# EAGLE design 08A-005 (EAGLE 6.3)
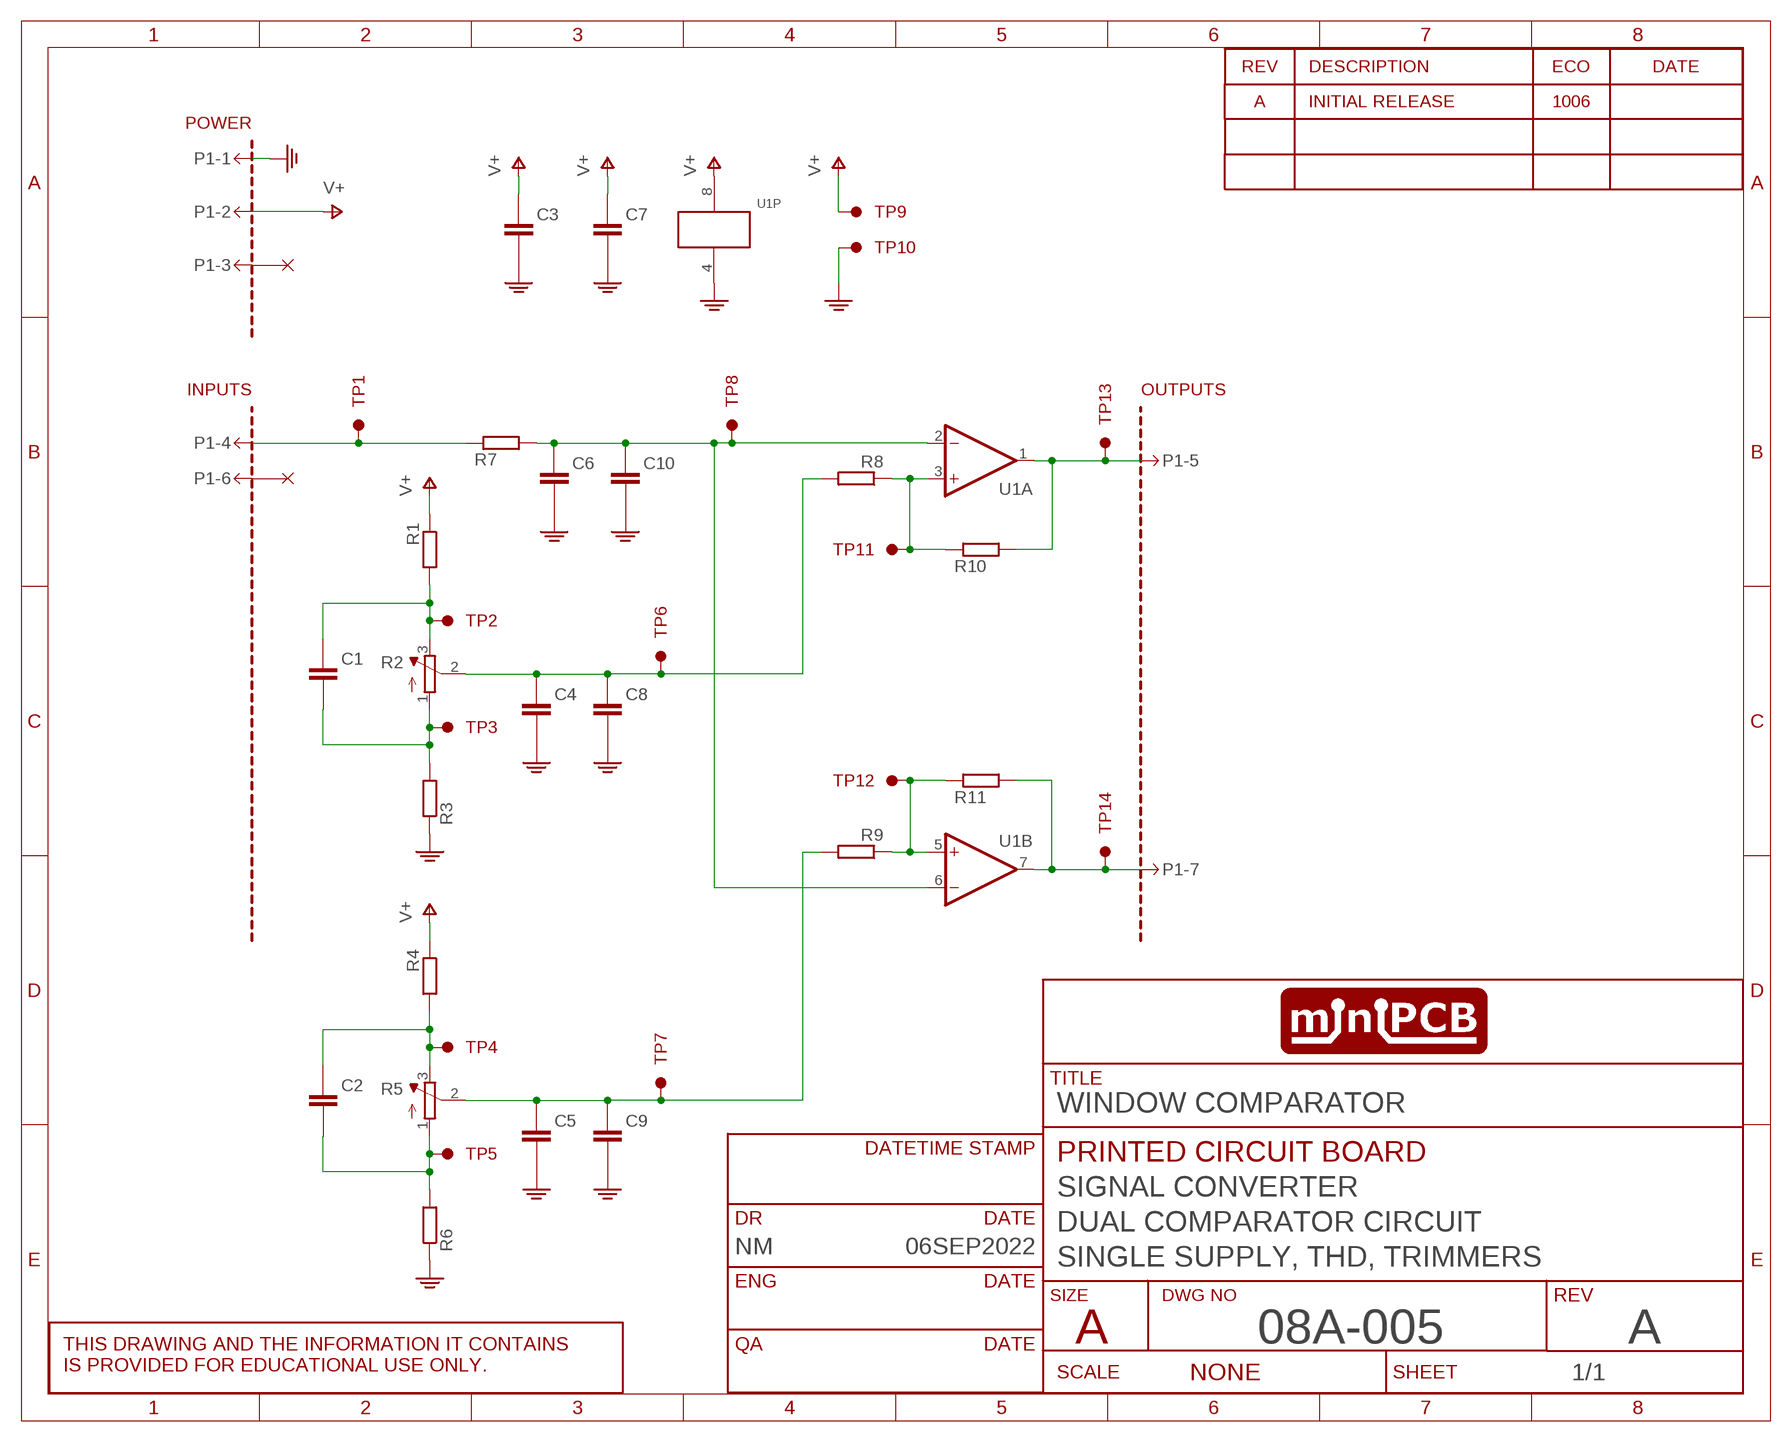
[diagram p0: schematic, sheet 1]
SHEET1 (SCHEMATIC): CIRCUIT_CATEGORY: SIGNAL CONVERTER; CIRCUIT_NAME: DUAL COMPARATOR CIRCUIT; CIRCUIT_VARIANT: SINGLE SUPPLY, THD, TRIMMERS; DR: NM; DR_DATE: 06SEP2022; REVA: A; REVA_ECO: 1006; REVISION: A; TITLE: WINDOW COMPARATOR

## Parts
C1  CAPACITORTHD  [C050-024X044]
C2  CAPACITORTHD  [C050-024X044]
C3  CAPACITORTHD  [C050-024X044]
C4  CAPACITORTHD  [C050-024X044]
C5  CAPACITORTHD  [C050-024X044]
C6  CAPACITORTHD  [C050-024X044]
C7  CAPACITORTHD  [C050-024X044]
C8  CAPACITORTHD  [C050-024X044]
C9  CAPACITORTHD  [C050-024X044]
C10  CAPACITORTHD  [C050-024X044]
P1-  MINIPCB_7P50  [MINIPCB_7P_50X50]
R1  RESISTOR10MM  [0207/10]
R2  TRIMPOT0.100THD  [TRIM_0100]
R3  RESISTOR10MM  [0207/10]
R4  RESISTOR10MM  [0207/10]
R5  TRIMPOT0.100THD  [TRIM_0100]
R6  RESISTOR10MM  [0207/10]
R7  RESISTOR10MM  [0207/10]
R8  RESISTOR10MM  [0207/10]
R9  RESISTOR10MM  [0207/10]
R10  RESISTOR10MM  [0207/10]
R11  RESISTOR10MM  [0207/10]
TP1  TESTPOINTKE5000-SMTEXT  [PINS_1_TESTPOINT_KE5000_NOTEXT]
TP2  TESTPOINTKE5000-SMTEXT  [PINS_1_TESTPOINT_KE5000_NOTEXT]
TP3  TESTPOINTKE5000-SMTEXT  [PINS_1_TESTPOINT_KE5000_NOTEXT]
TP4  TESTPOINTKE5000-SMTEXT  [PINS_1_TESTPOINT_KE5000_NOTEXT]
TP5  TESTPOINTKE5000-SMTEXT  [PINS_1_TESTPOINT_KE5000_NOTEXT]
TP6  TESTPOINTKE5000-SMTEXT  [PINS_1_TESTPOINT_KE5000_NOTEXT]
TP7  TESTPOINTKE5000-SMTEXT  [PINS_1_TESTPOINT_KE5000_NOTEXT]
TP8  TESTPOINTKE5000-SMTEXT  [PINS_1_TESTPOINT_KE5000_NOTEXT]
TP9  TESTPOINTKE5000-SMTEXT  [PINS_1_TESTPOINT_KE5000_NOTEXT]
TP10  TESTPOINTKE5000-SMTEXT  [PINS_1_TESTPOINT_KE5000_NOTEXT]
TP11  TESTPOINTKE5000-SMTEXT  [PINS_1_TESTPOINT_KE5000_NOTEXT]
TP12  TESTPOINTKE5000-SMTEXT  [PINS_1_TESTPOINT_KE5000_NOTEXT]
TP13  TESTPOINTKE5000-SMTEXT  [PINS_1_TESTPOINT_KE5000_NOTEXT]
TP14  TESTPOINTKE5000-SMTEXT  [PINS_1_TESTPOINT_KE5000_NOTEXT]
U1  OPAMP_DUALTHD  [DIL08]

## Nets
BIASA: C4.1(+) C8.1(+) R2.2(S) R8.2 TP6.1
BIASB: C5.1(+) C9.1(+) R5.2(S) R9.2 TP7.1
GND: C3.2(-) C4.2(-) C5.2(-) C6.2(-) C7.2(-) C8.2(-) C9.2(-) C10.2(-) P1-.1 R3.1 R6.1 TP10.1 U1.4(P:V-)
IN: P1-.4 R7.1 TP1.1
IN-: C6.1(+) C10.1(+) R7.2 TP8.1 U1.2(A:-IN) U1.6(B:-IN)
INA+: R8.1 R10.1 TP11.1 U1.3(A:+IN)
INB+: R9.1 R11.1 TP12.1 U1.5(B:+IN)
OUTA: P1-.5 R10.2 TP13.1 U1.1(A:OUT)
OUTB: P1-.7 R11.2 TP14.1 U1.7(B:OUT)
R2.1: C1.2(-) R2.1(A) R3.2 TP3.1
R2.3: C1.1(+) R1.2 R2.3(E) TP2.1
R5.1: C2.2(-) R5.1(A) R6.2 TP5.1
R5.3: C2.1(+) R4.2 R5.3(E) TP4.1
V+: C3.1(+) C7.1(+) P1-.2 R1.1 R4.1 TP9.1 U1.8(P:V+)
Unconnected: P1-.3 P1-.6

## Library data of the parts
C1-C10 = minipcb:CAPACITOR
P1- = minipcb:MINIPCB_7P; PART_NUMBER: X08A-005-A; REVISION: A
R1 R3 R4 R6-R11 = minipcb:RESISTOR
R2 R5 = minipcb:TRIMPOT: SMT trimmer potentiometer part number TC33X http://www.ladyada.net/library/eagle
TP1-TP14 = minipcb:TESTPOINT
U1 = minipcb:OPAMP_DUAL: OP AMP

## Board
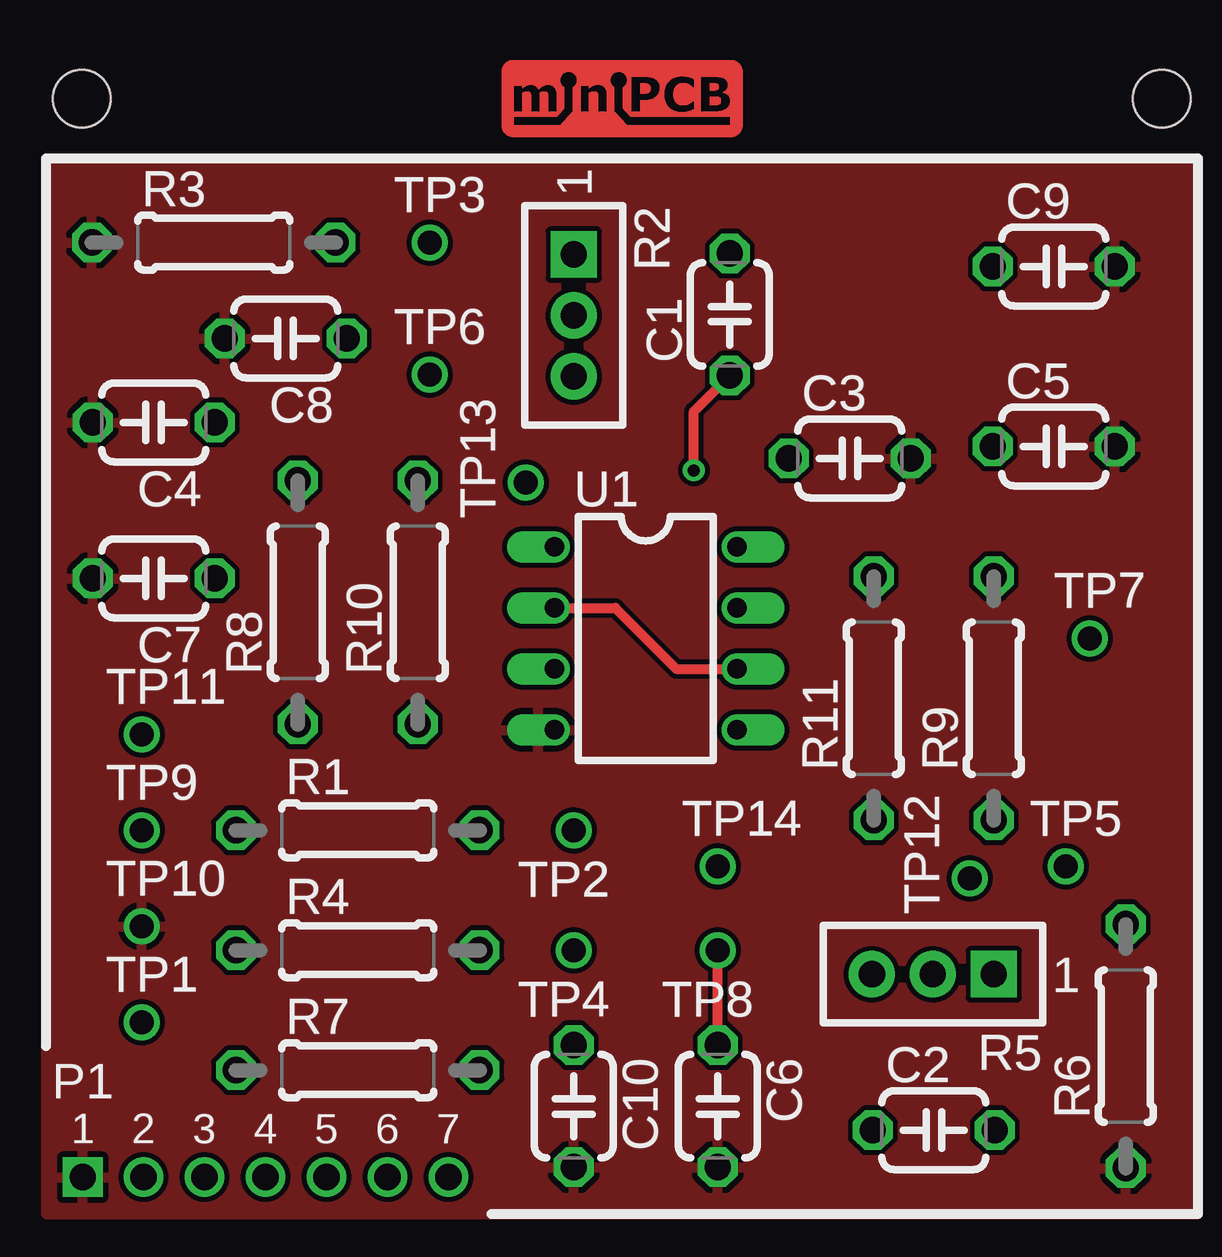
[diagram p1: board, top side]
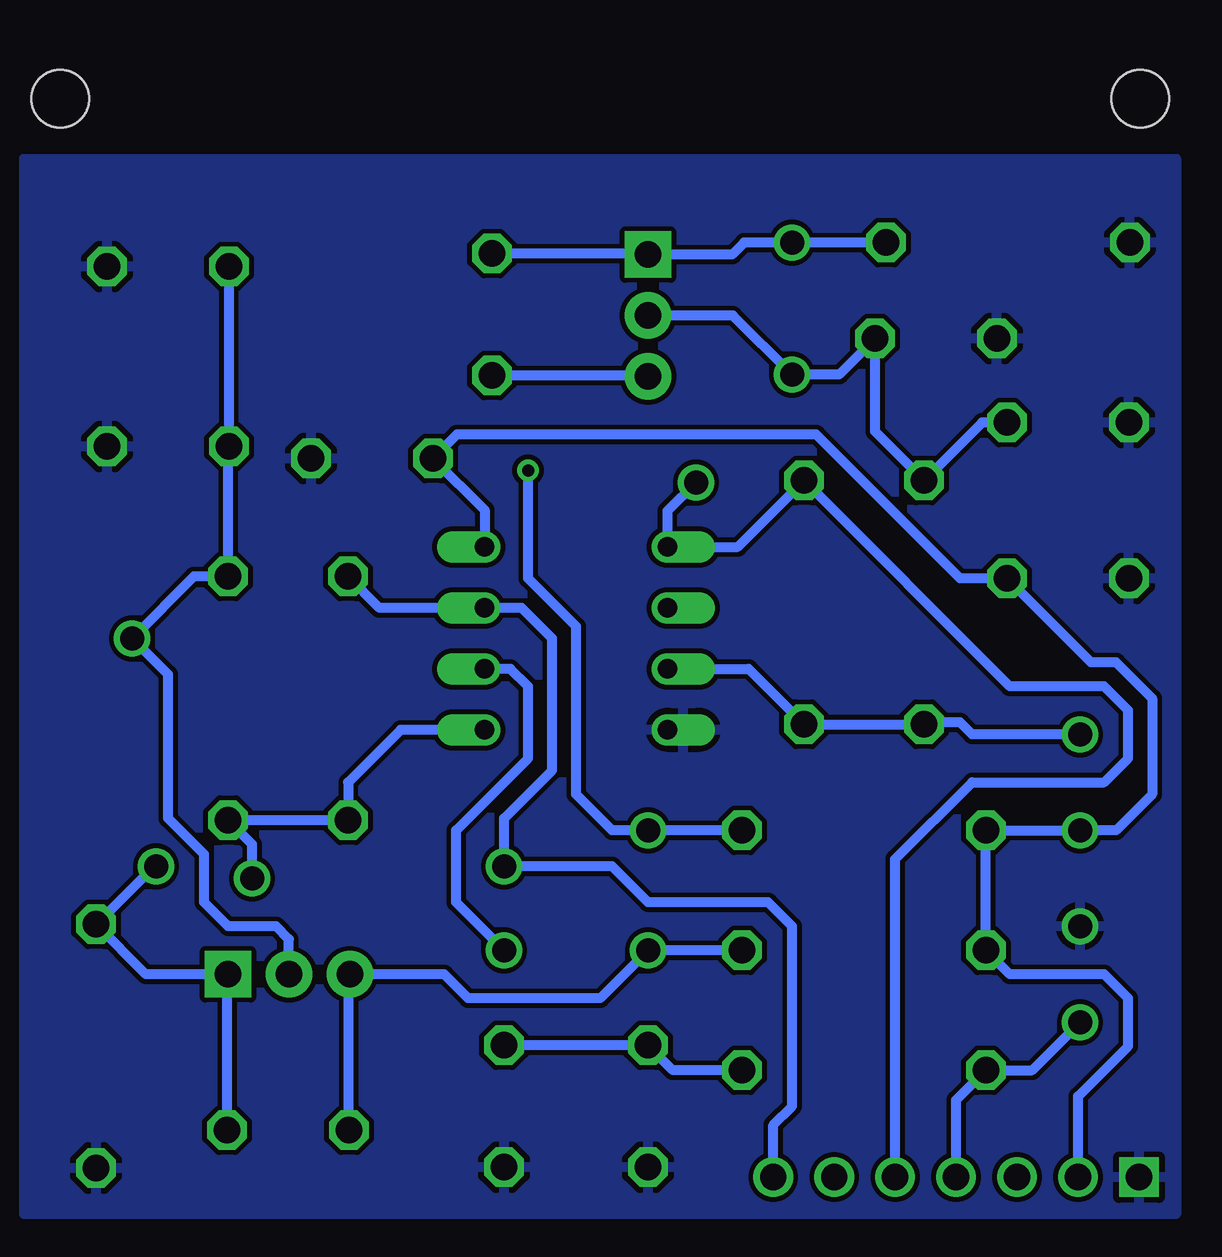
[diagram p2: board, bottom side, seen from below]

No outline drawn. Coordinates in mm, seen from the top.
Copper layers (1*16): Top 0.035mm / dielectric 1.5mm / Bottom 0.035mm
Design rules "minipcb": minimum track width 10mil, minimum drill 24mil, track to track 8mil, track to pad 8mil, pad to pad 8mil, via to via 8mil, smd to smd 8mil, copper to edge 40mil, drill to drill 8mil, minimum pad ring 10mil, minimum via ring 8mil, stop-mask expansion 4mil, vias tented up to drill 20mil, thermal gap 10mil

### Footprints (pad centres in the part's own frame; a part is rotated, then mirrored left to right if it is on the bottom)
C050-024X044 = drill 1.1 octagon: 1 -2.54,0; 2 2.54,0
MINIPCB_7P_50X50 = drill 1.1 square: 1 2.54,2.54 | drill 1.1: 2 5.08,2.54; 3 7.62,2.54; 4 10.16,2.54; 5 12.7,2.54; 6 15.24,2.54; 7 17.78,2.54 | hole 2.4: 47.5,47.5; 2.5,47.5
0207/10 = drill 1.1 octagon: 1 -5.08,0; 2 5.08,0
TRIM_0100 = drill 1.1 pad 1.93 square: 1 0,0 | drill 1.1 pad 1.93: 2 2.54,0; 3 5.08,0
PINS_1_TESTPOINT_KE5000_NOTEXT = drill 1: 1 0,0
DIL08 = drill 0.813 offset: 1 -3.81,-3.81; 2 -1.27,-3.81; 3 1.27,-3.81; 4 3.81,-3.81; 5 3.81,3.81; 6 1.27,3.81; 7 -1.27,3.81; 8 -3.81,3.81

### Placement (x,y rotation side)
C1  29.5,38.5 90 top
C2  38,4.5 0 top
C3  34.5,32.5 0 top
C4  5.5,34 180 top
C5  43,33 0 top
C6  29,5.5 270 top
C7  5.5,27.5 180 top
C8  11,37.5 180 top
C9  43,40.5 0 top
C10  23,5.5 270 top
P1-  0,0 0 top
R1  14,17 0 top
R2  23,41 270 top
R3  8,41.5 0 top
R4  14,12 0 top
R5  40.5,11 180 top
R6  46,8 90 top
R7  14,7 0 top
R8  11.5,26.5 90 top
R9  40.5,22.5 90 top
R10  16.5,26.5 90 top
R11  35.5,22.5 90 top
TP1  5,9 0 top
TP2  23,17 180 top
TP3  17,41.5 0 top
TP4  23,12 180 top
TP5  43.5,15.5 0 top
TP6  17,36 0 top
TP7  44.5,25 0 top
TP8  29,12 180 top
TP9  5,17 0 top
TP10  5,13 0 top
TP11  5,21 0 top
TP12  39.5,15 90 top
TP13  21,31.5 90 top
TP14  29,15.5 0 top
U1  26,25 270 top

### Tracks (layer width: path | path; a pad name or v marks a point on that pad's centre or on a via)
BIASA
  Bottom 0.406: C4.1 9.08,34 R8.2 13.54,33.62 C8.1 15.04,36 TP6.1 19.46,38.46 R2.2
BIASB
  Bottom 0.406: R5.2 37.96,12.46 38.5,13 40.5,13 41.5,14 41.5,16 43,17.5 43,23.5 TP7.1 41.92,27.58 R9.2 40.5,32.96 C5.1 C9.1
GND
  pour Bottom: 1,1 49,1 49,45 2,45 1,45
  pour Top: 1,1 49,1 49,45 2,45 1,45
IN
  Bottom 0.406: P1-.4 10.16,5.76 R7.1 7,7 TP1.1
IN-
  Top 0.406: C6.1 TP8.1 | U1.2 24.73,26.27 27.27,23.73 U1.6
  Bottom 0.406: R7.2 21.96,7 C10.1 C6.1 | TP8.1 31,14 31,17 28,20 28,23 28.73,23.73 U1.6
INA+
  Bottom 0.406: U1.3 18.81,23.73 R10.1 R8.1 11.42,21.5 10,21.5 9.5,21 TP11.1
INB+
  Bottom 0.406: U1.5 33.31,21.19 35.5,19 R11.1 R9.1 39.5,16.42 TP12.1
OUTA
  Bottom 0.406: P1-.5 12.7,15.8 9.5,19 4,19 3,20 3,22 4,23 7.92,23 R10.2 19.27,28.81 U1.1 22.19,30.31 TP13.1
OUTB
  Bottom 0.406: P1-.7 17.78,4.72 17,5.5 17,13 18,14 23,14 24.5,15.5 TP14.1 29,17.5 27,19.5 27,25 28.27,26.27 U1.7 34.19,26.27 R11.2
R2.1
  Bottom 0.406: R3.2 TP3.1 19,41.5 19.5,41 R2.1 23.04,41.04 C1.2
R2.3  (via drill 0.5)
  Top 0.406: v28,32 28,34.46 C1.1
  Bottom 0.406: R2.3 23.04,35.96 C1.1 | R1.2 TP2.1 24.5,17 26,18.5 26,25.5 28,27.5 v28,32
R5.1
  Bottom 0.406: C2.2 40.54,10.96 R5.1 43.92,11 R6.2 43.58,15.5 TP5.1
R5.3
  Bottom 0.406: R4.2 TP4.1 25,10 30.5,10 31.5,11 R5.3 35.46,10.96 C2.1
V+
  Bottom 0.406: P1-.2 5.08,5.92 3,8 3,10 4,11 7.92,11 R4.1 R1.1 TP9.1 3.5,17 2,18.5 2,22.5 3.5,24 4.54,24 C7.1 10,27.5 16,33.5 30.96,33.5 C3.1 29.81,30.35 U1.8

### Text on the board
_tNames: R3 | TP3 | R2 | C9 | TP6 | C1 | C8 | C3 | C5 | C4 | TP13 | U1 | C7 | TP7 | R8 | R10 | TP11 | R11 | R9 | TP9 | R1 | TP14 | TP5 | TP2 | TP10 | R4 | TP12 | TP4 | TP8 | TP1 | R7 | R5 | C10 | C6 | C2 | R6